# Altium schematic sheet UserClock.SchDoc: FPGA Motherboard for Digital Multiplexed Readout, McGill U.
size Letter; DocumentNumber: DfMUX15; Revision: Rev0, Prototype; SheetNumber: 15; SheetTotal: 27; PageSetup: Record=PageOptions|CenterHorizontal=True|CenterVertical=True|PrintScale=0.93|XCorrection=1.00|YCorrection=1.00|PrintKind=0|BorderSize=5000000|LeftOffset=0|BottomOffset=0|Orientation=2|PaperLength=1000|PaperWidth=1000|Scale=100|PaperSource=7|PrintQuality=-4|MediaType=1|DitherType=10|PaperKind=Letter|PrintScaleMode=1
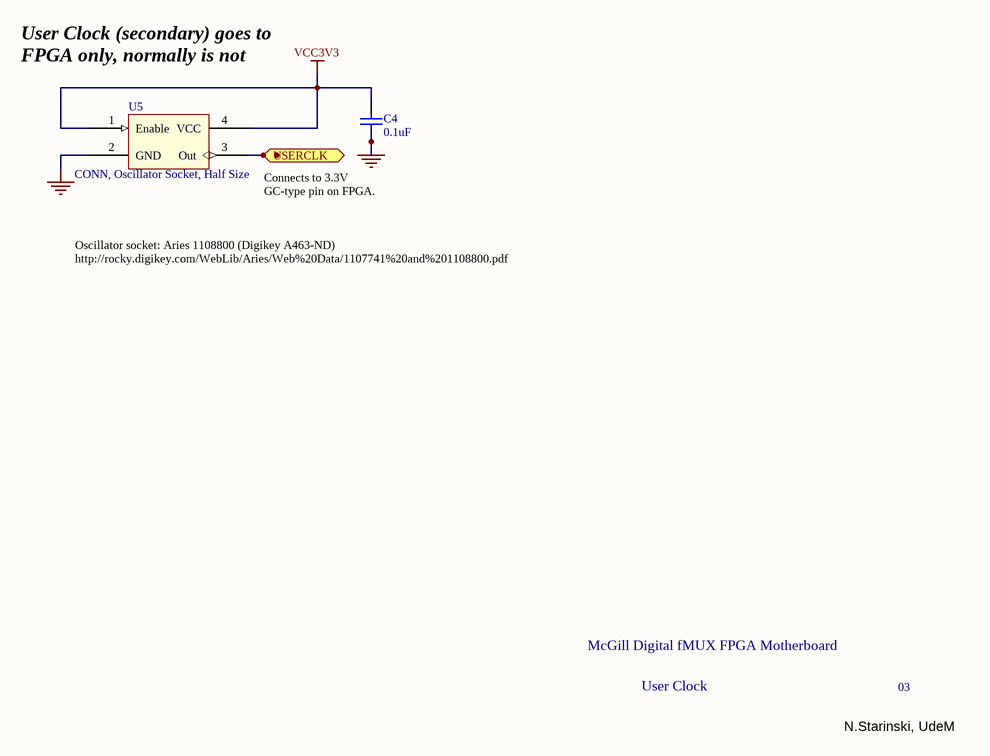
[diagram p0: UserClock.SchDoc]

## Parts
C4  0.1uF  [CC1608-0603]
U5  CONN, Oscillator Socket, Half Size  [DIP_Osc]

## Ports
USERCLK (out)

## Nets
GND: C4.1 U5.2(GND)
VCC3V3: C4.2 U5.1(Enable) U5.4(VCC)
USERCLK: U5.3(Out) ; port USERCLK

## Notes on the sheet
- User Clock (secondary) goes to
  FPGA only, normally is not used.
- Connects to 3.3V
  GC-type pin on FPGA.
- Oscillator socket: Aries 1108800 (Digikey A463-ND)
  http://rocky.digikey.com/WebLib/Aries/Web%20Data/1107741%20and%201108800.pdf
- McGill Digital fMUX FPGA Motherboard
- User Clock
- 03
- N.Starinski, UdeM

## Library data of the parts
C4 = Cap Semi: Capacitor (Semiconductor SIM Model); Published: 8-Jun-2000; LatestRevisionDate: 17-Jul-2002; LatestRevisionNote: Re-released for DXP Platform.; PackageReference: C1206; Publisher: Altium Limited
U5 = Osc_Socket: 1108800 ARIES Oscillator Socket